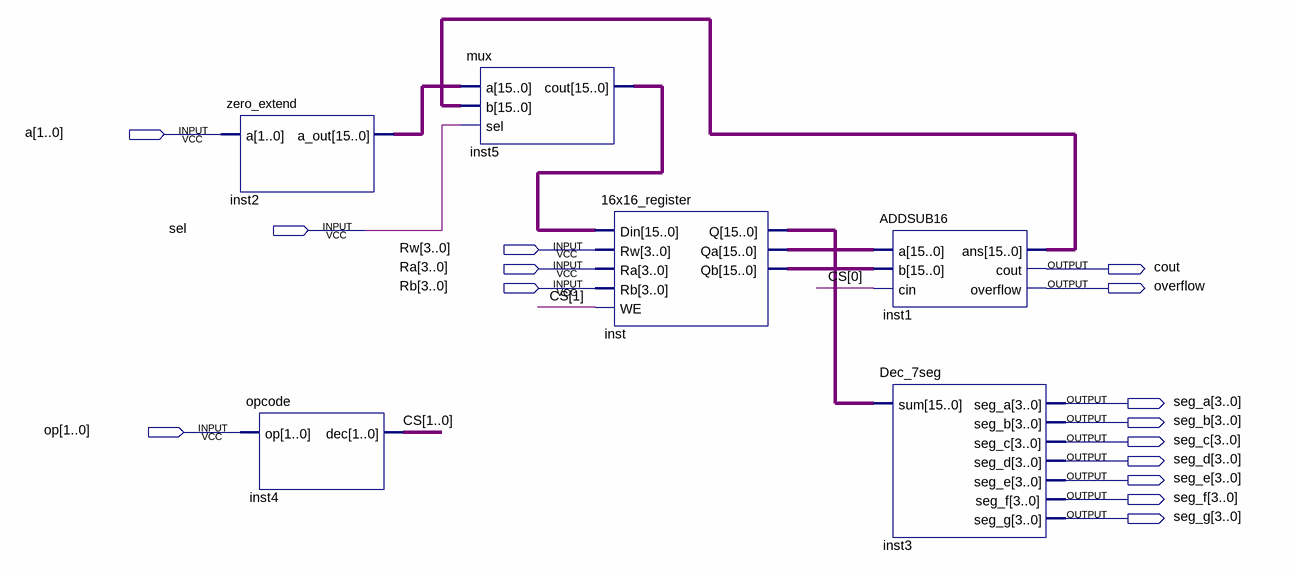
[diagram p0: schematic sheet]
// Quartus schematic Single_Cycle_CPU.bdf as structural Verilog: 6 symbols, 15 pins
module Single_Cycle_CPU (
  input  [1:0] a,
  input  sel,
  input  [3:0] Rw,
  input  [3:0] Ra,
  input  [3:0] Rb,
  input  [1:0] op,
  output cout,
  output overflow,
  output [3:0] seg_a,
  output [3:0] seg_b,
  output [3:0] seg_c,
  output [3:0] seg_d,
  output [3:0] seg_e,
  output [3:0] seg_f,
  output [3:0] seg_g
);

  wire [1:0] CS;
  wire [15:0] inst1_ans, inst2_a_out, inst5_cout, inst_q, inst_qa, inst_qb;

  zero_extend inst2 (.a(a), .a_out(inst2_a_out));
  opcode inst4 (.op(op), .dec(CS));
  mux inst5 (.a(inst2_a_out), .b(inst1_ans), .sel(sel), .cout(inst5_cout));
  \16x16_register  inst (
    .Din(inst5_cout), .Rw(Rw), .Ra(Ra), .Rb(Rb), .WE(CS[1]), .Q(inst_q), .Qa(inst_qa), .Qb(inst_qb));
  ADDSUB16 inst1 (.a(inst_qa), .b(inst_qb), .cin(CS[0]), .ans(inst1_ans), .cout(cout), .overflow(overflow));
  Dec_7seg inst3 (
    .sum(inst_q), .seg_a(seg_a), .seg_b(seg_b), .seg_c(seg_c), .seg_d(seg_d), .seg_e(seg_e), .seg_f(seg_f),
    .seg_g(seg_g));
endmodule
